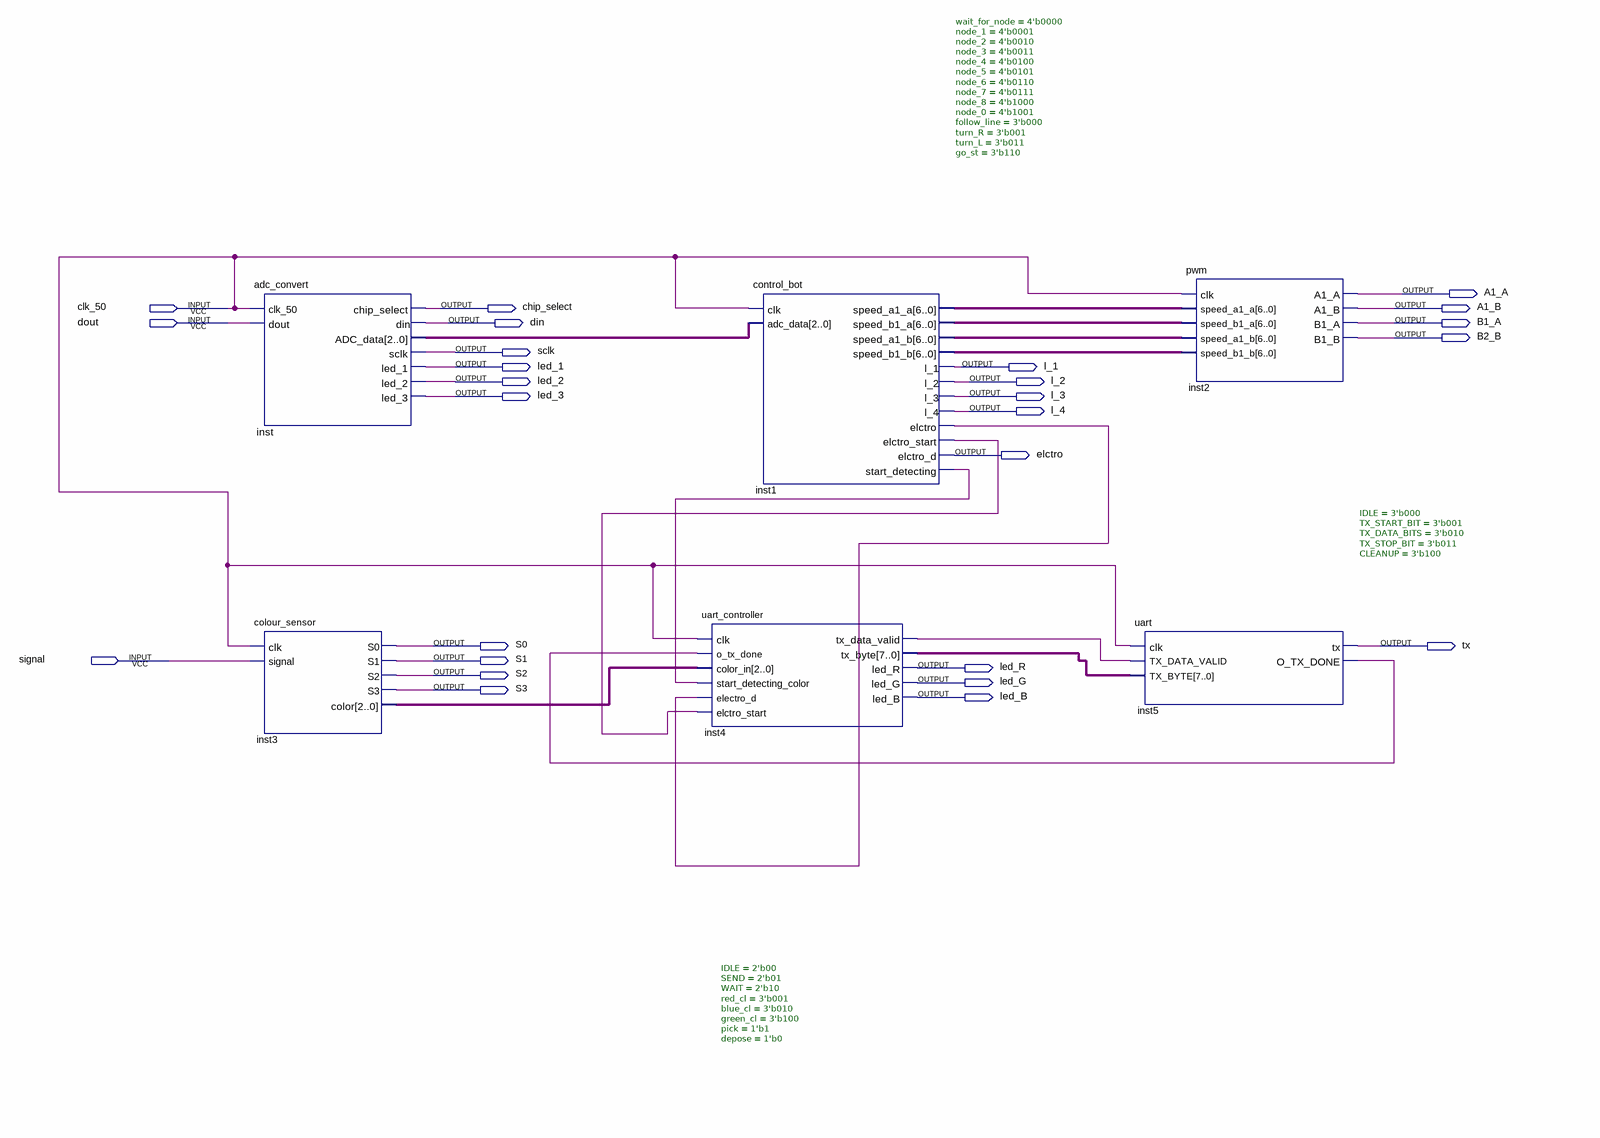
[diagram p0: schematic sheet]
// Quartus schematic SM_1038_BLOCK_DAIGRAM.bdf as structural Verilog: 6 symbols, 26 pins
module SM_1038_BLOCK_DAIGRAM (
  input  clk_50,
  input  dout,
  input  signal,
  output A1_A,
  output chip_select,
  output A1_B,
  output din,
  output B1_A,
  output B2_B,
  output sclk,
  output led_1,
  output l_1,
  output led_2,
  output l_2,
  output led_3,
  output l_3,
  output l_4,
  output elctro,
  output S0,
  output tx,
  output S1,
  output led_R,
  output S2,
  output led_G,
  output S3,
  output led_B
);

  wire inst1_elctro, inst1_elctro_start, inst1_start_detecting, inst4_tx_data_valid, inst5_o_tx_done;
  wire [2:0] inst3_color, inst_adc_data;
  wire [6:0] inst1_speed_a1_a, inst1_speed_a1_b, inst1_speed_b1_a, inst1_speed_b1_b;
  wire [7:0] inst4_tx_byte;

  adc_convert inst (
    .clk_50(clk_50), .dout(dout), .chip_select(chip_select), .din(din), .ADC_data(inst_adc_data),
    .sclk(sclk), .led_1(led_1), .led_2(led_2), .led_3(led_3));
  colour_sensor inst3 (.clk(clk_50), .signal(signal), .S0(S0), .S1(S1), .S2(S2), .S3(S3), .color(inst3_color));
  uart_controller #(.IDLE(2'b00), .SEND(2'b01), .WAIT(2'b10), .red_cl(3'b001), .blue_cl(3'b010), .green_cl(3'b100), .pick(1'b1), .depose(1'b0)) inst4 (
    .clk(clk_50), .o_tx_done(inst5_o_tx_done), .color_in(inst3_color),
    .start_detecting_color(inst1_start_detecting), .electro_d(inst1_elctro),
    .elctro_start(inst1_elctro_start), .tx_data_valid(inst4_tx_data_valid), .tx_byte(inst4_tx_byte),
    .led_R(led_R), .led_G(led_G), .led_B(led_B));
  control_bot #(.wait_for_node(4'b0000), .node_1(4'b0001), .node_2(4'b0010), .node_3(4'b0011), .node_4(4'b0100), .node_5(4'b0101), .node_6(4'b0110), .node_7(4'b0111), .node_8(4'b1000), .node_0(4'b1001), .follow_line(3'b000), .turn_R(3'b001), .turn_L(3'b011), .go_st(3'b110)) inst1 (
    .clk(clk_50), .adc_data(inst_adc_data), .speed_a1_a(inst1_speed_a1_a), .speed_b1_a(inst1_speed_b1_a),
    .speed_a1_b(inst1_speed_a1_b), .speed_b1_b(inst1_speed_b1_b), .l_1(l_1), .l_2(l_2), .l_3(l_3), .l_4(l_4),
    .elctro(inst1_elctro), .elctro_start(inst1_elctro_start), .elctro_d(elctro),
    .start_detecting(inst1_start_detecting));
  uart #(.IDLE(3'b000), .TX_START_BIT(3'b001), .TX_DATA_BITS(3'b010), .TX_STOP_BIT(3'b011), .CLEANUP(3'b100)) inst5 (
    .clk(clk_50), .TX_DATA_VALID(inst4_tx_data_valid), .TX_BYTE(inst4_tx_byte), .tx(tx),
    .O_TX_DONE(inst5_o_tx_done));
  pwm inst2 (
    .clk(clk_50), .speed_a1_a(inst1_speed_a1_a), .speed_b1_a(inst1_speed_b1_a),
    .speed_a1_b(inst1_speed_a1_b), .speed_b1_b(inst1_speed_b1_b), .A1_A(A1_A), .A1_B(A1_B), .B1_A(B1_A),
    .B1_B(B2_B));
endmodule
